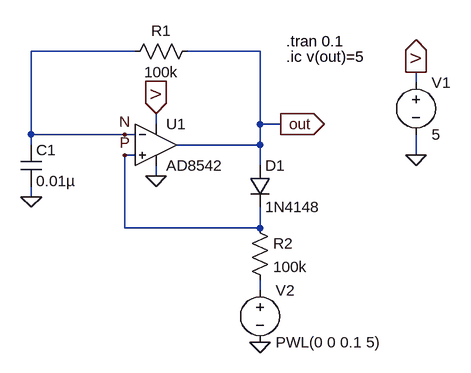
[diagram p0: schematic VCO.asc]
VCO.asc, the LTspice schematic file:
Version 4
SHEET 1 880 680
WIRE 144 16 -16 16
WIRE 336 16 224 16
WIRE 576 64 576 48
WIRE 176 128 176 112
WIRE 336 128 336 16
WIRE 368 128 336 128
WIRE -16 144 -16 16
WIRE 128 144 -16 144
WIRE 144 144 128 144
WIRE -16 160 -16 144
WIRE 336 160 336 128
WIRE 336 160 208 160
WIRE 144 176 128 176
WIRE 576 176 576 144
WIRE 336 192 336 160
WIRE 176 208 176 192
WIRE -16 240 -16 224
WIRE 128 288 128 176
WIRE 336 288 336 256
WIRE 336 288 128 288
WIRE 336 384 336 368
FLAG 576 48 V
IOPIN 576 48 Out
FLAG 176 112 V
IOPIN 176 112 In
FLAG 368 128 out
IOPIN 368 128 Out
FLAG 128 144 N
FLAG 128 176 P
FLAG 576 176 0
FLAG 176 208 0
FLAG 336 464 0
FLAG -16 240 0
SYMBOL res 320 272 R0
SYMATTR InstName R2
SYMATTR Value 100k
SYMATTR SpiceLine tol=5 pwr=0.25
SYMBOL voltage 576 48 R0
WINDOW 123 0 0 Left 0
WINDOW 39 0 0 Left 0
SYMATTR InstName V1
SYMATTR Value 5
SYMBOL cap -32 160 R0
SYMATTR InstName C1
SYMATTR Value 0.01µ
SYMATTR SpiceLine V=50 Irms=160m Rser=0.444602 Lser=0 mfg="KEMET" pn="C1812C103K5RAC" type="X7R"
SYMBOL voltage 336 368 R0
WINDOW 123 0 0 Left 0
WINDOW 39 0 0 Left 0
SYMATTR InstName V2
SYMATTR Value PWL(0 0 0.1 5)
SYMBOL diode 320 192 R0
SYMATTR InstName D1
SYMATTR Value 1N4148
SYMBOL AD8542 176 96 R0
SYMATTR InstName U1
SYMBOL res 240 0 R90
WINDOW 0 0 56 VBottom 2
WINDOW 3 32 56 VTop 2
SYMATTR InstName R1
SYMATTR Value 100k
SYMATTR SpiceLine tol=5 pwr=0.25
TEXT 376 0 Left 2 !.tran 0.1
TEXT 376 24 Left 2 !.ic v(out)=5

The netlist it stands for:
* VCO.asc
R2 P N001 100k tol=5 pwr=0.25
V1 V 0 5
C1 N 0 0.01µ V=50 Irms=160m Rser=0.444602 Lser=0 mfg="KEMET" pn="C1812C103K5RAC" type="X7R"
V2 N001 0 PWL(0 0 0.1 5)
D1 out P 1N4148
XU1 P N V 0 out AD8542  ; pins In+ In- V+ V- OUT
R1 out N 100k tol=5 pwr=0.25
.model D D
.lib standard.dio
.tran 0.1
.ic v(out)=5
.lib AD8542.sub
.backanno
.end